# Altium schematic sheet ESP32-S3 module.SchDoc: ESP32-C3-WROOM-02
size A4; Organization: TechLabs Global (Pvt) Ltd; DocumentNumber: 2; Revision: 1.1; SheetNumber: 2; SheetTotal: 2
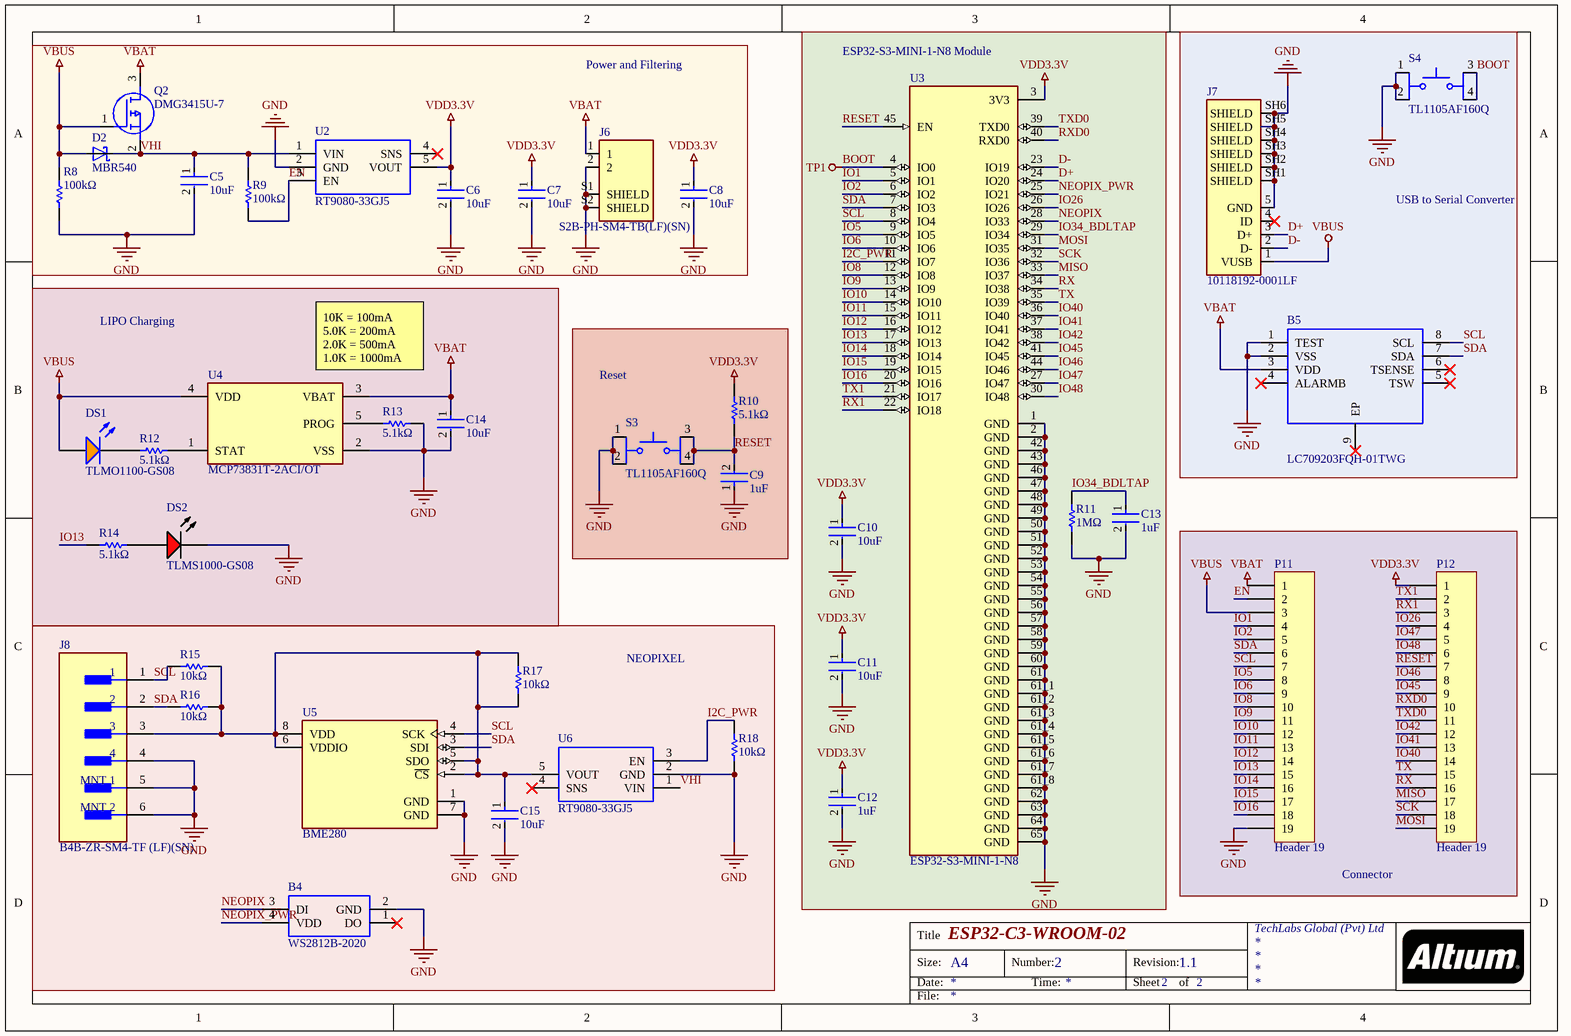
[diagram p0: ESP32-S3 module.SchDoc]

## Parts
B4  WS2812B-2020  [WS2812B2020]
B5  LC709203FQH-01TWG  [SON65P400X300X80-9N]
C5  10uF  [FP-CL10-IPC_C]
C6  10uF  [FP-CL10-IPC_C]
C7  10uF  [FP-CL10-IPC_C]
C8  10uF  [FP-CL10-IPC_C]
C9  1uF  [FP-CL10-IPC_A]
C10  10uF  [FP-CL10-IPC_C]
C11  10uF  [FP-CL10-IPC_C]
C12  1uF  [FP-CL10-IPC_A]
C13  1uF  [FP-CL10-IPC_A]
C14  10uF  [FP-CL10-IPC_C]
C15  10uF  [FP-CL10-IPC_C]
D2  MBR540  [DIOAD2120W130L950D530P]
DS1  TLMO1100-GS08  [VISH-TLMX1100-2_V]
DS2  TLMS1000-GS08  [VISH-TLMS1000_V]
J6  S2B-PH-SM4-TB(LF)(SN)  [JST_S2B-PH-SM4-TB(LF)(SN)]
J7  10118192-0001LF  [AMPHENOL_10118192-0001LF]
J8  B4B-ZR-SM4-TF (LF)(SN)  [FP-B4B-ZR-SM4-TF_LF_SN-MFG]
P11  Header 19  [HDR1X19]
P12  Header 19  [HDR1X19]
Q2  DMG3415U-7  [SOT96P240X120-3N]
R8  100kΩ  [RESC1005X40X25NL05T10]
R9  100kΩ  [RESC1005X40X25NL05T10]
R10  5.1kΩ  [RESC1005X40X25NL05T10]
R11  1MΩ  [RESC1005X40X25NL05T10]
R12  5.1kΩ  [RESC1005X40X25NL05T10]
R13  5.1kΩ  [RESC1005X40X25NL05T10]
R14  5.1kΩ  [RESC1005X40X25NL05T10]
R15  10kΩ  [RESC1005X40X25LL05T10]
R16  10kΩ  [RESC1005X40X25LL05T10]
R17  10kΩ  [RESC1005X40X25LL05T10]
R18  10kΩ  [RESC1005X40X25LL05T10]
S3  TL1105AF160Q  [TL1105AF160Q]
S4  TL1105AF160Q  [TL1105AF160Q]
U2  RT9080-33GJ5  [SOT94P280X100-5N]
U3  ESP32-S3-MINI-1-N8  [XCVR_ESP32-S3-MINI-1-N8]
U4  MCP73831T-2ACI/OT  [FP-C04-091-OT-IPC_B]
U5  BME280  [FP-BME280-MFG]
U6  RT9080-33GJ5  [SOT94P280X100-5N]

## Blocks framed on the sheet
Power and Filtering: C5-C8 D2 J6 Q2 R8 R9 U2
ESP32-S3-MINI-1-N8 Module: C10-C13 R11 U3
USB to Serial Converter: B5 J7 S4
LIPO Charging: C14 DS1 DS2 R12-R14 U4
Reset: C9 R10 S3
Connector: P11 P12
NEOPIXEL: B4 C15 J8 R15-R18 U5 U6

## Nets
BOOT: S4.3 S4.4 U3.4(IO0)  [also labelled TP1]
GND: B4.2(GND) B5.1(TEST) B5.2(VSS) C5.2 C6.2 C7.2 C8.2 C9.1 C10.2 C11.2 C12.2 C13.2 C14.2 C15.2 DS2.2(K) J6.2 J6.S1(SHIELD) J6.S2(SHIELD) J7.5(GND) J7.SH1(SHIELD) J7.SH2(SHIELD) J7.SH3(SHIELD) J7.SH4(SHIELD) J7.SH5(SHIELD) J7.SH6(SHIELD) J8.4 J8.5(MNT_1) J8.6(MNT_2) P11.19 R8.1 R11.1 R13.1 R18.1 S3.1 S3.2 S4.1 S4.2 U2.2(GND) U3.1(GND) U3.2(GND) U3.42(GND) U3.43(GND) U3.46(GND) U3.47(GND) U3.48(GND) U3.49(GND) U3.50(GND) U3.51(GND) U3.52(GND) U3.53(GND) U3.54(GND) U3.55(GND) U3.56(GND) U3.57(GND) U3.58(GND) U3.59(GND) U3.60(GND) U3.61(GND) U3.61_1(GND) U3.61_2(GND) U3.61_3(GND) U3.61_4(GND) U3.61_5(GND) U3.61_6(GND) U3.61_7(GND) U3.61_8(GND) U3.62(GND) U3.63(GND) U3.64(GND) U3.65(GND) U4.2(VSS) U5.1(GND) U5.7(GND) U6.2(GND)
VBAT: B5.3(VDD) C14.1 J6.1 P11.1 Q2.3(D) U4.3(VBAT)
VBUS: D2.A DS1.1(A) J7.1(VUSB) P11.3 Q2.1(G) R8.2 U4.4(VDD)
VDD3.3V: C6.1 C7.1 C8.1 C10.1 C11.1 C12.1 P12.1 R10.2 U2.5(VOUT) U3.3(3V3)
D+: J7.3(D+) U3.24(IO20)
D-: J7.2(D-) U3.23(IO19)
EN: P11.2 R9.2 U2.3(EN)
I2C_PWR: R18.2 U3.11(IO7) U6.3(EN)
IO1: P11.4 U3.5(IO1)
IO2: P11.5 U3.6(IO2)
IO5: P11.8 U3.9(IO5)
IO6: P11.9 U3.10(IO6)
IO8: P11.10 U3.12(IO8)
IO9: P11.11 U3.13(IO9)
IO10: P11.12 U3.14(IO10)
IO11: P11.13 U3.15(IO11)
IO12: P11.14 U3.16(IO12)
IO13: P11.15 R14.2 U3.17(IO13)
IO14: P11.16 U3.18(IO14)
IO15: P11.17 U3.19(IO15)
IO16: P11.18 U3.20(IO16)
IO26: P12.4 U3.26(IO26)
IO34_BDLTAP: C13.1 R11.2 U3.29(IO34)
IO40: P12.14 U3.36(IO40)
IO41: P12.13 U3.37(IO41)
IO42: P12.12 U3.38(IO42)
IO45: P12.9 U3.41(IO45)
IO46: P12.8 U3.44(IO46)
IO47: P12.5 U3.27(IO47)
IO48: P12.6 U3.30(IO48)
MISO: P12.17 U3.33(IO37)
MOSI: P12.19 U3.31(IO35)
NEOPIX: B4.3(DI) U3.28(IO33)
NEOPIX_PWR: B4.4(VDD) U3.25(IO21)
RESET: C9.2 P12.7 R10.1 S3.3 S3.4 U3.45(EN)
RX: P12.16 U3.34(IO38)
RX1: P12.3 U3.22(IO18)
RXD0: P12.10 U3.40(RXD0)
SCK: P12.18 U3.32(IO36)
SCL: B5.8(SCL) J8.1 P11.7 R15.2 U3.8(IO4) U5.4(SCK)
SDA: B5.7(SDA) J8.2 P11.6 R16.2 U3.7(IO3) U5.3(SDI)
TX: P12.15 U3.35(IO39)
TX1: P12.2 U3.21(IO17)
TXD0: P12.11 U3.39(TXD0)
VHI: C5.1 D2.C Q2.2(S) R9.1 U2.1(VIN) U6.1(VIN)
NetC15_1: C15.1 J8.3 R15.1 R16.1 R17.1 R17.2 U5.2(~{CS}) U5.5(SDO) U5.6(VDDIO) U5.8(VDD) U6.5(VOUT)
NetDS1_2: DS1.2(K) R12.2
NetDS2_1: DS2.1(A) R14.1
NetR12_1: R12.1 U4.1(STAT)
NetR13_2: R13.2 U4.5(PROG)

Not connected (* = marked no-connect by the designer): B4 1(DO)*; B5 4(ALARMB)* 5(TSW)* 6(TSENSE)* 9(EP)*; J7 4(ID)*; U2 4(SNS)*; U6 4(SNS)*

## Notes on the sheet
- (near U4) 10K = 100mA                                                                     5.0K = 200mA                                                                                        2.0K = 500mA                                                                                        1.0K = 1000mA
- Title
- Size:
- Date:
- A4
- Number:
- Time:
- Revision:
- Sheet
- of
- File:

## Library data of the parts
B4 = WS2812B-2020: RGB SMD,2x2mm Light Emitting Diodes (LED) ROHS; Manufacturer: Worldsemi; Mfr.Part #: WS2812B-2020; Package: SMD,2x2mm; Packaging: Tape & Reel (TR); LCSC Part#: C965555; Datasheet: https://www.mouser.com/pdfDocs/WS2812B-2020_V10_EN_181106150240761.pdf
B5 = LC709203FQH-01TWG: DFN-8-EP(3x4) Battery Management ICs ROHS; Manufacturer: onsemi; Mfr.Part #: LC709203FQH-01TWG; Packaging: Tape & Reel (TR); Datasheet: https://datasheet.lcsc.com/lcsc/1809111522_onsemi-LC709203FQH-01TWG_C152311.pdf; Package: DFN-8-EP(3x4); LCSC Part#: C152311
C5-C8 C10 C11 C14 C15 = CMP-13271-004224-1: X5R 25V 10uF ±20% 0603 Multilayer Ceramic Capacitors MLCC - SMD/SMT ROHS; Mfr. Part #: CL10A106MA8NRNC; Manufacturer: Samsung Electro-Mechanics; Datasheet: https://datasheet.lcsc.com/lcsc/1811110921_Samsung-Electro-Mechanics-CL10A106MA8NRNC_C96446.pdf; Value: 10uF; LCSC Part #: C96446; Package: 0603; Packaging: Tape and Reel
C9 = CMP-13271-001457-1: X5R 1uF 16V ±10% 0603 Multilayer Ceramic Capacitors MLCC - SMD/SMT ROHS; Manufacturer: Samsung Electro-Mechanics; Mfr. Part #: CL10A105KO8NNNC; Value: 1uF; LCSC Part #: C1592; Packaging: Tape & Reel (TR); Package: 0603; Datasheet: https://datasheet.lcsc.com/lcsc/2209191700_Samsung-Electro-Mechanics-CL10A105KO8NNNC_C1592.pdf
C12 C13 = CMP-13271-001457-1: X5R 1uF 16V ±10% 0603 Multilayer Ceramic Capacitors MLCC - SMD/SMT ROHS; Mfr. Part #: CL10A105KO8NNNC; Manufacturer: Samsung Electro-Mechanics; Value: 1uF; Datasheet: 0.031inch; LCSC Part #: C1592; Packaging: Tape & Reel (TR); Package: 0603
D2 = MBR540-DO-201AD: 40V 5A 580mV@5A DO-201AD Schottky Barrier Diodes (SBD) ROHS; Manufacturer: Jilin Sino-Microelectronics; Package: DO-201AD; Datasheet: https://datasheet.lcsc.com/lcsc/1811081224_Jilin-Sino-Microelectronics-MBR540-DO-201AD_C272410.pdf; LCSC Part #: C272410; Mfr. Part #: MBR540-DO-201AD
DS1 = CMP-1666-00029-1: 0603 Light Emitting Diodes (LED) ROHS; Manufacturer: Vishay Intertech; ComponentLink1URL: http://www.vishay.com/; Datasheet: https://datasheet.lcsc.com/lcsc/2207121830_Vishay-Intertech-TLMO1100-GS08_C3148192.pdf; Packaging: Tape & Reel (TR); ComponentLink2Description: Datasheet; Package: 0603; ComponentLink1Description: Manufacturer URL; Mfr. Part #: TLMO1100-GS08; LCSC Part #: C3148192; ComponentLink2URL: http://download.siliconexpert.com/pdfs/2016/8/7/12/43/26/667/vsh_/manual/379263299541529tlmb1100.pdf
DS2 = CMP-2000-07254-1: Red 0603 Light Emitting Diodes (LED) ROHS; Manufacturer: Vishay Intertech; Package: 0603; Packaging: Tape & Reel (TR); LCSC Part #: C241893; Datasheet: https://datasheet.lcsc.com/lcsc/1810181516_Vishay-Intertech-TLMS1000-GS08_C241893.pdf; Mfr. Part #: TLMS1000-GS08
J6 = S2B-PH-SM4-TB(LF)(SN): 1x2P PH 1 2mm Male pin 2 -25℃~+85℃ 2A Surface Mount SMD,P=2mm Wire To Board / Wire To Wire Connector ROHS; Manufacturer: JST Sales America; LCSC Part #: C295747; Datasheet: https://datasheet.lcsc.com/lcsc/2102031704_JST-Sales-America-S2B-PH-SM4-TB-LF-SN_C295747.pdf; Package: SMD,P=2mm; Mfr. Part #: S2B-PH-SM4-TB(LF)(SN); Packaging: Tape & Reel (TR)
J7 = 10118192-0001LF: Single Port 5 Contact Horizontal Right Angle Shielded Micro B USB 2.0 Connector; Manufacturer: Amphenol ICC; Mfr. Part #: 10118192-0001LF; Package: SMD; LCSC Part #: C132564; Datasheet: https://datasheet.lcsc.com/lcsc/2111290930_Amphenol-ICC-10118192-0001LF_C132564.pdf
J8 = CMP-17439-000604-1: 1x4P 1 1.5mm 4 Brass SMD,P=1.5mm Wire To Board / Wire To Wire Connector ROHS; Manufacturer: JST Sales America; Packaging: Tape & Reel (TR); Mfr. Part #: B4B-ZR-SM4-TF(LF)(SN); LCSC Part #: C265083; Package: SMD,P=1.5mm; Datasheet: https://datasheet.lcsc.com/lcsc/1912111437_JST-Sales-America-B4B-ZR-SM4-TF-LF-SN_C265083.pdf
P11 P12 = Header 19: Header, 19-Pin; LatestRevisionDate: 17-Jul-2002; LatestRevisionNote: Re-released for DXP Platform.; Publisher: Altium Limited
Q2 = DMG3415U-7: 20V 4A 39mΩ@4.5V,4A 900mW P Channel SOT-23 MOSFETs ROHS; Manufacturer: Diodes Incorporated; Mfr.Part #: DMG3415U-7; Packaging: Tape & Reel (TR); Package: SOT-23; Datasheet: https://datasheet.lcsc.com/lcsc/1809191942_Diodes-Incorporated-DMG3415U-7_C96616.pdf; LCSC Part#: C96616
R8 R9 = CMP-2002-07343-1: 62.5mW 100kΩ ±1% Thick Film Resistors 0402 Chip Resistor - Surface Mount ROHS; Mfr.Part #: RC0402FR-07100KL; Manufacturer: YAGEO; Value: 100kΩ; LCSC Part#: C60491; Datasheet: https://datasheet.lcsc.com/lcsc/1809291220_YAGEO-RC0402FR-07100KL_C60491.pdf; Packaging: Tape & Reel (TR); Package: 0402
R10 R12-R14 = CMP-2002-07753-1: 62.5mW Thick Film Resistors ±1% 5.1kΩ 0402 Chip Resistor - Surface Mount ROHS; Mfr. Part #: RC0402FR-075K1L; Manufacturer: YAGEO; Datasheet: https://datasheet.lcsc.com/lcsc/1809201112_YAGEO-RC0402FR-075K1L_C105872.pdf; LCSC Part #: C105872; Package: 0402; Packaging: Tape & Reel (TR); Value: 5.1kΩ
R11 = CMP-2002-07490-1: 62.5mW Thick Film Resistors ±1% 1MΩ 0402 Chip Resistor - Surface Mount ROHS; Mfr. Part #: RC0402FR-071ML; Manufacturer: YAGEO; Datasheet: https://datasheet.lcsc.com/lcsc/1809201123_YAGEO-RC0402FR-071ML_C138033.pdf; LCSC Part #: C138033; Package: 0402; Packaging: Tape & Reel (TR); Value: 1MΩ
R15-R18 = CMP-2002-07353-1: 10kΩ Thick Film Resistors 62.5mW ±1% 0402 Chip Resistor - Surface Mount ROHS; Mfr. Part #: RC0402FR-0710KL; Manufacturer: YAGEO; Value: 10kΩ; LCSC Part #: C60490; Package: 0402; Datasheet: https://datasheet.lcsc.com/lcsc/1809301715_YAGEO-RC0402FR-0710KL_C60490.pdf; Packaging: Tape & Reel (TR)
S3 S4 = TL1105AF160Q: 6mm 1.4mm Round Button 50mA Straight 6mm SPST 12V Plugin,6x6mm Tactile Switches ROHS; Manufacturer: E-Switch; Datasheet: https://datasheet.lcsc.com/lcsc/1809291031_E-Switch-TL1105AF160Q_C273465.pdf; Mfr. Part #: TL1105AF160Q; Package: Plugin,6x6mm; LCSC Part #: C273465; Packaging: Bag-packed
U2 U6 = RT9080-33GJ5: TSOT-23-5 Linear Voltage Regulators (LDO) ROHS; Manufacturer: Richtek Tech; Mfr.Part #: RT9080-33GJ5; Package: TSOT-23-5; LCSC Part#: C841192; Datasheet: https://datasheet.lcsc.com/lcsc/2009192305_Richtek-Tech-RT9080-33GJ5_C841192.pdf; Packaging: Tape & Reel (TR)
U3 = U?: Bluetooth, WiFi 802.11b/g/n, Bluetooth v5.0 Transceiver Module 2.4GHz PCB Trace Surface Mount; Manufacturer: Espressif Systems; Mfr. Part #: ESP32-S3-MINI-1-N8; Datasheet: https://www.espressif.com/sites/default/files/documentation/esp32-s3-mini-1_mini-1u_datasheet_en.pdf; LCSC Part #: C2913206; Package: None; Packaging: Tape & Reel (TR)
U4 = CMP-0133-00143-2: SOT-23-5 Battery Management ICs ROHS; Manufacturer: Microchip Tech; LCSC Part #: C424093; Mfr. Part #: MCP73831T-2ACI/OT; Package: SOT-23-5; Packaging: Tape & Reel (TR); Datasheet: https://datasheet.lcsc.com/lcsc/1912111437_Microchip-Tech-MCP73831T-2ACI-OT_C424093.pdf
U5 = CMP-2000-05073-3: LGA-8 Temperature and Humidity Sensor ROHS; Manufacturer: Bosch Sensortec; Packaging: Tape & Reel (TR); Datasheet: https://datasheet.lcsc.com/lcsc/2302171709_Bosch-Sensortec-BME280_C92489.pdf; LCSC Part #: C92489; Mfr. Part #: BME280; Package: LGA-8